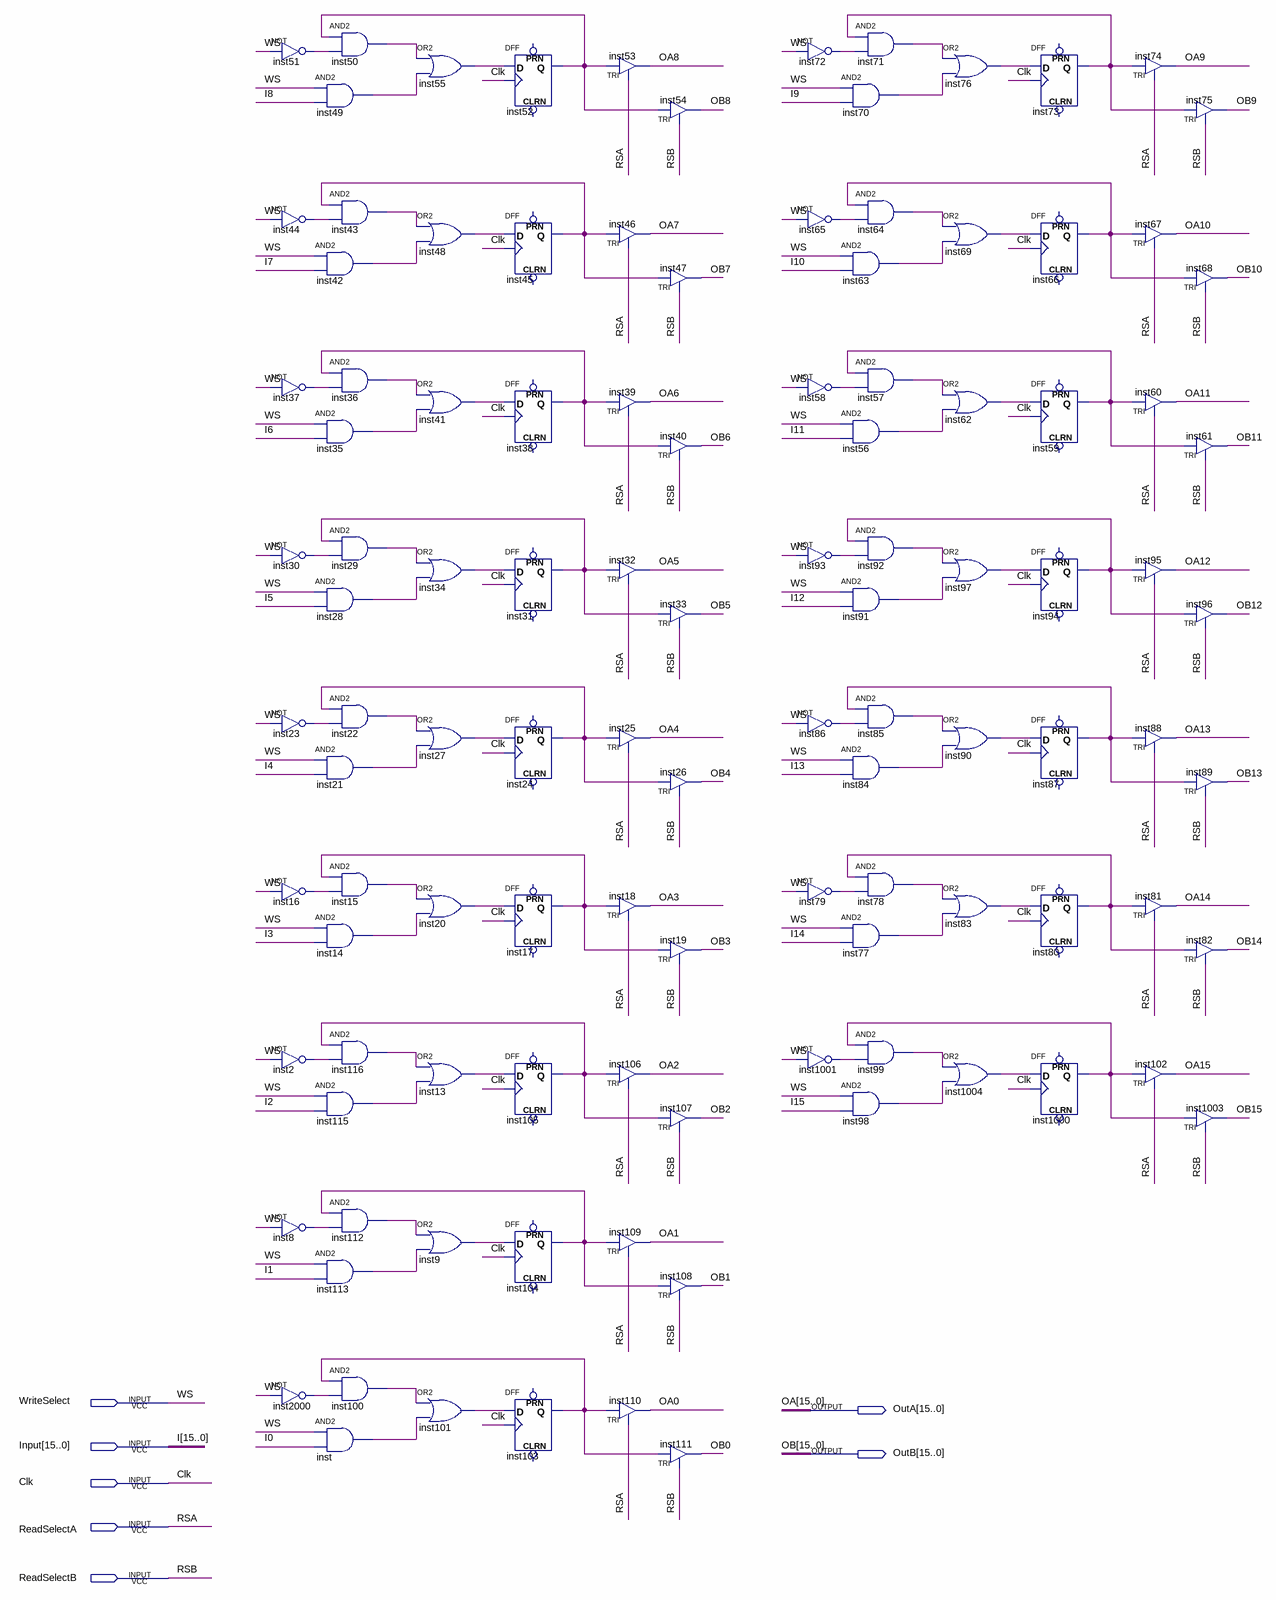
[diagram p0: schematic sheet]
// Quartus schematic registerfilecell.bdf as structural Verilog: 112 symbols, 7 pins
module registerfilecell (
  input  WriteSelect,
  input  [15:0] Input,
  input  Clk,
  input  ReadSelectA,
  input  ReadSelectB,
  output [15:0] OutA,
  output [15:0] OutB
);

  wire inst2_out, inst8_out, inst9_out, inst13_out, inst14_out, inst15_out, inst16_out, inst17_q, inst20_out,
       inst21_out, inst22_out, inst23_out, inst24_q, inst27_out, inst28_out, inst29_out, inst30_out,
       inst31_q, inst34_out, inst35_out, inst36_out, inst37_out, inst38_q, inst41_out, inst42_out,
       inst43_out, inst44_out, inst45_q, inst48_out, inst49_out, inst50_out, inst51_out, inst52_q,
       inst55_out, inst56_out, inst57_out, inst58_out, inst59_q, inst62_out, inst63_out, inst64_out,
       inst65_out, inst66_q, inst69_out, inst70_out, inst71_out, inst72_out, inst73_q, inst76_out,
       inst77_out, inst78_out, inst79_out, inst80_q, inst83_out, inst84_out, inst85_out, inst86_out,
       inst87_q, inst90_out, inst91_out, inst92_out, inst93_out, inst94_q, inst97_out, inst98_out,
       inst99_out, inst100_out, inst101_out, inst103_q, inst104_q, inst105_q, inst112_out, inst113_out,
       inst115_out, inst116_out, inst1000_q, inst1001_out, inst1004_out, inst2000_out, inst_out;

  not inst51 (inst51_out, WriteSelect);
  not inst44 (inst44_out, WriteSelect);
  not inst37 (inst37_out, WriteSelect);
  not inst30 (inst30_out, WriteSelect);
  not inst23 (inst23_out, WriteSelect);
  not inst16 (inst16_out, WriteSelect);
  not inst2 (inst2_out, WriteSelect);
  not inst8 (inst8_out, WriteSelect);
  not inst2000 (inst2000_out, WriteSelect);
  and inst50 (inst50_out, inst52_q, inst51_out);
  and inst49 (inst49_out, WriteSelect, Input[8]);
  and inst43 (inst43_out, inst45_q, inst44_out);
  and inst42 (inst42_out, WriteSelect, Input[7]);
  and inst36 (inst36_out, inst38_q, inst37_out);
  and inst35 (inst35_out, WriteSelect, Input[6]);
  and inst29 (inst29_out, inst31_q, inst30_out);
  and inst28 (inst28_out, WriteSelect, Input[5]);
  and inst22 (inst22_out, inst24_q, inst23_out);
  and inst21 (inst21_out, WriteSelect, Input[4]);
  and inst15 (inst15_out, inst17_q, inst16_out);
  and inst14 (inst14_out, WriteSelect, Input[3]);
  and inst116 (inst116_out, inst105_q, inst2_out);
  and inst115 (inst115_out, WriteSelect, Input[2]);
  and inst112 (inst112_out, inst104_q, inst8_out);
  and inst113 (inst113_out, WriteSelect, Input[1]);
  and inst100 (inst100_out, inst103_q, inst2000_out);
  and inst (inst_out, WriteSelect, Input[0]);
  or inst55 (inst55_out, inst50_out, inst49_out);
  or inst48 (inst48_out, inst43_out, inst42_out);
  or inst41 (inst41_out, inst36_out, inst35_out);
  or inst34 (inst34_out, inst29_out, inst28_out);
  or inst27 (inst27_out, inst22_out, inst21_out);
  or inst20 (inst20_out, inst15_out, inst14_out);
  or inst13 (inst13_out, inst116_out, inst115_out);
  or inst9 (inst9_out, inst112_out, inst113_out);
  or inst101 (inst101_out, inst100_out, inst_out);
  DFF inst52 (.CLK(Clk), .D(inst55_out), .Q(inst52_q));  // open: CLRN, PRN
  DFF inst45 (.CLK(Clk), .D(inst48_out), .Q(inst45_q));  // open: CLRN, PRN
  DFF inst38 (.CLK(Clk), .D(inst41_out), .Q(inst38_q));  // open: CLRN, PRN
  DFF inst31 (.CLK(Clk), .D(inst34_out), .Q(inst31_q));  // open: CLRN, PRN
  DFF inst24 (.CLK(Clk), .D(inst27_out), .Q(inst24_q));  // open: CLRN, PRN
  DFF inst17 (.CLK(Clk), .D(inst20_out), .Q(inst17_q));  // open: CLRN, PRN
  DFF inst105 (.CLK(Clk), .D(inst13_out), .Q(inst105_q));  // open: CLRN, PRN
  DFF inst104 (.CLK(Clk), .D(inst9_out), .Q(inst104_q));  // open: CLRN, PRN
  DFF inst103 (.CLK(Clk), .D(inst101_out), .Q(inst103_q));  // open: CLRN, PRN
  TRI inst53 (.IN(inst52_q), .OE(ReadSelectA), .OUT(OutA[8]));
  TRI inst46 (.IN(inst45_q), .OE(ReadSelectA), .OUT(OutA[7]));
  TRI inst39 (.IN(inst38_q), .OE(ReadSelectA), .OUT(OutA[6]));
  TRI inst32 (.IN(inst31_q), .OE(ReadSelectA), .OUT(OutA[5]));
  TRI inst25 (.IN(inst24_q), .OE(ReadSelectA), .OUT(OutA[4]));
  TRI inst18 (.IN(inst17_q), .OE(ReadSelectA), .OUT(OutA[3]));
  TRI inst106 (.IN(inst105_q), .OE(ReadSelectA), .OUT(OutA[2]));
  TRI inst109 (.IN(inst104_q), .OE(ReadSelectA), .OUT(OutA[1]));
  TRI inst110 (.IN(inst103_q), .OE(ReadSelectA), .OUT(OutA[0]));
  TRI inst54 (.IN(inst52_q), .OE(ReadSelectB), .OUT(OutB[8]));
  TRI inst47 (.IN(inst45_q), .OE(ReadSelectB), .OUT(OutB[7]));
  TRI inst40 (.IN(inst38_q), .OE(ReadSelectB), .OUT(OutB[6]));
  TRI inst33 (.IN(inst31_q), .OE(ReadSelectB), .OUT(OutB[5]));
  TRI inst26 (.IN(inst24_q), .OE(ReadSelectB), .OUT(OutB[4]));
  TRI inst19 (.IN(inst17_q), .OE(ReadSelectB), .OUT(OutB[3]));
  TRI inst107 (.IN(inst105_q), .OE(ReadSelectB), .OUT(OutB[2]));
  TRI inst108 (.IN(inst104_q), .OE(ReadSelectB), .OUT(OutB[1]));
  TRI inst111 (.IN(inst103_q), .OE(ReadSelectB), .OUT(OutB[0]));
  not inst72 (inst72_out, WriteSelect);
  not inst65 (inst65_out, WriteSelect);
  not inst58 (inst58_out, WriteSelect);
  not inst93 (inst93_out, WriteSelect);
  not inst86 (inst86_out, WriteSelect);
  not inst79 (inst79_out, WriteSelect);
  not inst1001 (inst1001_out, WriteSelect);
  and inst71 (inst71_out, inst73_q, inst72_out);
  and inst70 (inst70_out, WriteSelect, Input[9]);
  and inst64 (inst64_out, inst66_q, inst65_out);
  and inst63 (inst63_out, WriteSelect, Input[10]);
  and inst57 (inst57_out, inst59_q, inst58_out);
  and inst56 (inst56_out, WriteSelect, Input[11]);
  and inst92 (inst92_out, inst94_q, inst93_out);
  and inst91 (inst91_out, WriteSelect, Input[12]);
  and inst85 (inst85_out, inst87_q, inst86_out);
  and inst84 (inst84_out, WriteSelect, Input[13]);
  and inst78 (inst78_out, inst80_q, inst79_out);
  and inst77 (inst77_out, WriteSelect, Input[14]);
  and inst99 (inst99_out, inst1000_q, inst1001_out);
  and inst98 (inst98_out, WriteSelect, Input[15]);
  or inst76 (inst76_out, inst71_out, inst70_out);
  or inst69 (inst69_out, inst64_out, inst63_out);
  or inst62 (inst62_out, inst57_out, inst56_out);
  or inst97 (inst97_out, inst92_out, inst91_out);
  or inst90 (inst90_out, inst85_out, inst84_out);
  or inst83 (inst83_out, inst78_out, inst77_out);
  or inst1004 (inst1004_out, inst99_out, inst98_out);
  DFF inst73 (.CLK(Clk), .D(inst76_out), .Q(inst73_q));  // open: CLRN, PRN
  DFF inst66 (.CLK(Clk), .D(inst69_out), .Q(inst66_q));  // open: CLRN, PRN
  DFF inst59 (.CLK(Clk), .D(inst62_out), .Q(inst59_q));  // open: CLRN, PRN
  DFF inst94 (.CLK(Clk), .D(inst97_out), .Q(inst94_q));  // open: CLRN, PRN
  DFF inst87 (.CLK(Clk), .D(inst90_out), .Q(inst87_q));  // open: CLRN, PRN
  DFF inst80 (.CLK(Clk), .D(inst83_out), .Q(inst80_q));  // open: CLRN, PRN
  DFF inst1000 (.CLK(Clk), .D(inst1004_out), .Q(inst1000_q));  // open: CLRN, PRN
  TRI inst74 (.IN(inst73_q), .OE(ReadSelectA), .OUT(OutA[9]));
  TRI inst67 (.IN(inst66_q), .OE(ReadSelectA), .OUT(OutA[10]));
  TRI inst60 (.IN(inst59_q), .OE(ReadSelectA), .OUT(OutA[11]));
  TRI inst95 (.IN(inst94_q), .OE(ReadSelectA), .OUT(OutA[12]));
  TRI inst88 (.IN(inst87_q), .OE(ReadSelectA), .OUT(OutA[13]));
  TRI inst81 (.IN(inst80_q), .OE(ReadSelectA), .OUT(OutA[14]));
  TRI inst102 (.IN(inst1000_q), .OE(ReadSelectA), .OUT(OutA[15]));
  TRI inst75 (.IN(inst73_q), .OE(ReadSelectB), .OUT(OutB[9]));
  TRI inst68 (.IN(inst66_q), .OE(ReadSelectB), .OUT(OutB[10]));
  TRI inst61 (.IN(inst59_q), .OE(ReadSelectB), .OUT(OutB[11]));
  TRI inst96 (.IN(inst94_q), .OE(ReadSelectB), .OUT(OutB[12]));
  TRI inst89 (.IN(inst87_q), .OE(ReadSelectB), .OUT(OutB[13]));
  TRI inst82 (.IN(inst80_q), .OE(ReadSelectB), .OUT(OutB[14]));
  TRI inst1003 (.IN(inst1000_q), .OE(ReadSelectB), .OUT(OutB[15]));

  // Other names for the same wires on the sheet: I[15:0] = Input; I0 = Input[0]; I1 = Input[1]; I2 = Input[2];
  //   I3 = Input[3]; I4 = Input[4]; I5 = Input[5]; I6 = Input[6]; I7 = Input[7]; I8 = Input[8]; I9 = Input[9];
  //   I10 = Input[10]; I11 = Input[11]; I12 = Input[12]; I13 = Input[13]; I14 = Input[14]; I15 = Input[15];
  //   OA[15:0] = OutA; OA0 = OutA[0]; OA1 = OutA[1]; OA2 = OutA[2]; OA3 = OutA[3]; OA4 = OutA[4]; OA5 = OutA[5];
  //   OA6 = OutA[6]; OA7 = OutA[7]; OA8 = OutA[8]; OA9 = OutA[9]; OA10 = OutA[10]; OA11 = OutA[11]; OA12 = OutA[12];
  //   OA13 = OutA[13]; OA14 = OutA[14]; OA15 = OutA[15]; OB[15:0] = OutB; OB0 = OutB[0]; OB1 = OutB[1]; OB2 = OutB[2];
  //   OB3 = OutB[3]; OB4 = OutB[4]; OB5 = OutB[5]; OB6 = OutB[6]; OB7 = OutB[7]; OB8 = OutB[8]; OB9 = OutB[9];
  //   OB10 = OutB[10]; OB11 = OutB[11]; OB12 = OutB[12]; OB13 = OutB[13]; OB14 = OutB[14]; OB15 = OutB[15];
  //   RSA = ReadSelectA; RSB = ReadSelectB; WS = WriteSelect
endmodule
